# Altium schematic sheet Diode Controllers.SchDoc
size A; Organization: Underwater Robotics; Address1: c/o Student Involvement; Address2: Campus Box 7306; Address3: 2016 Cates Ave. Raleigh, NC 27695; Revision: A1; SheetNumber: 4B; SheetTotal: 4B
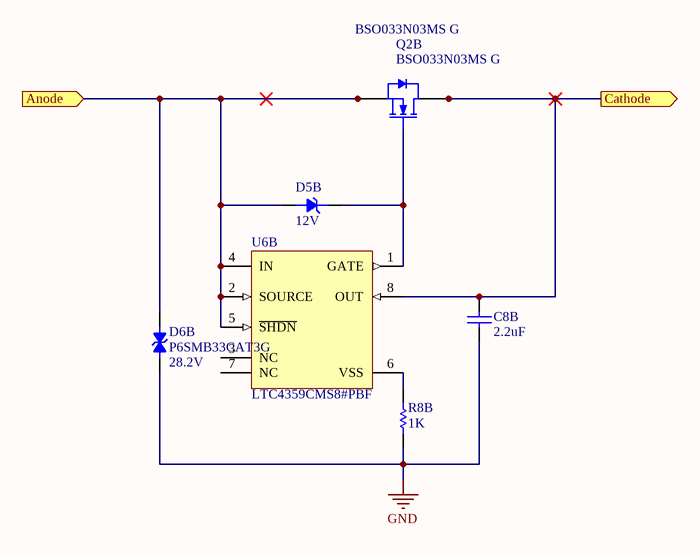
[diagram p0: Diode Controllers.SchDoc]

## Parts
C8B  value 2.2uF  [C1206]  (hidden comment: 2.2uF, C1206 TY , Ceramic MLCC)
D5B  Zener Voltage Vz Typ: 12V  [ONSC-SOD-523-2-502-01_C_V]  (hidden comment: MM5Z12VT1G, 12V Zener)
D6B  value 28.2V  Manufacturer Part Number: P6SMB33CAT3G  [ONSC-SMB-2-403A-03_H_V]  (hidden comment: Bidirectional Zener)
Q2B  BSO033N03MS G  [INF-PG-DSO-8-3_N]
R8B  value 1K  [R0603]  (hidden comment: Resistor)
U6B  LTC4359CMS8#PBF  [LT-MS8-8_N]

## Ports
Anode (in), Cathode (out)

## Nets
GND: C8B.1(+) D6B.2 R8B.1
Anode: D5B.1 D6B.1 Q2B.1(SOURCE) Q2B.2(SOURCE) Q2B.3(SOURCE) U6B.2(SOURCE) U6B.4(IN) U6B.5(~{SHDN}) ; port Anode
Cathode: C8B.2 Q2B.5(DRAIN) Q2B.6(DRAIN) Q2B.7(DRAIN) Q2B.8(DRAIN) U6B.8(OUT) ; port Cathode
NetD5B_2: D5B.2 Q2B.4(GATE) U6B.1(GATE)
NetR8B_2: R8B.2 U6B.6(VSS)

Not connected (* = marked no-connect by the designer): U6B 3(NC) 7(NC)

## Notes on the sheet
- Title
- Size:
- Date:
- A
- Number:
- Time:
- Revision:
- Sheet
- of
- File:

## Library data of the parts
C8B = 2.2uF, C1206 TY , Ceramic MLCC: Ceramic MLCC, Taiyo Yuden, X7R Dielectric; Manufacturer Part Number: UMK316F225ZG-T; Description 1: TAIYO YUDEN - UMK316F225ZG-T - CERAMIC CAPACITOR, 2.2UF, 50V, Y5V, +80,-20%, 1206; Supplier 1: Newark; Supplier Part Number 1: 08P5201; Manufacturer 1: TAIYO YUDEN; RoHS: YES; Stock 1: 1843; Pricing 1: 1=0.055, 10=0.055, 50=0.055, 100=0.055, 500=0.055, 1000=0.05 (USD); ComponentLink1URL: http://www.yuden.co.jp/productdata/catalog/en/mlcc_pack_e.pdf; ComponentLink1Description: http://www.yuden.co.jp/productdata/catalog/en/mlcc_pack_e.pdf; ComponentLink2URL: http://www.farnell.com/datasheets/1481447.pdf; ComponentLink2Description: http://www.farnell.com/datasheets/1481447.pdf
D5B = MM5Z12VT1G, 12V Zener: Zener diode; Manufacturer 1: ON SEMICONDUCTOR; Description 1: ON SEMICONDUCTOR - MM5Z12VT1G - ZENER DIODE, 200mW, 12V, SOD-523; Power Dissipation Pd: 200; Diode Case Style: SOD-523; No. of Pins: 2; Filter Terminals: SMD; Supplier 1: Newark; Supplier Part Number 1: 09R9512; RoHS: YES; Stock 1: 4492; Pricing 1: 1=0.249, 50=0.162, 100=0.068, 250=0.066, 500=0.064, 1000=0.046, 3000=0.037, 9000=0.03 (USD); Zener Tolerance: -; Operating Temperature Max: 150 C; Packaging: Cut Tape; ComponentLink1URL: http://www.farnell.com/datasheets/1840567.pdf; ComponentLink1Description: http://www.farnell.com/datasheets/1840567.pdf; Manufacturer Part Number: MM5Z12VT1G
D6B = P6SMB33CAT3G 28.2V Bidirectional Zener: Bidirectional Zener diode; Manufacturer 1: ON SEMICONDUCTOR; Description 1: ON SEMICONDUCTOR - P6SMB33CAT3G - TVS DIODE, 600W, 33V, SMB; Supplier 1: Newark; Supplier Part Number 1: 42K2552; RoHS: YES; Stock 1: 6401; Pricing 1: 1=0.543, 50=0.36, 100=0.202, 250=0.195, 500=0.19, 1000=0.151, 2500=0.13, 7500=0.126 (USD); ComponentLink1URL: http://www.farnell.com/datasheets/1576153.pdf; ComponentLink1Description: http://www.farnell.com/datasheets/1576153.pdf
Q2B = BSO033N03MS G: N-Channel OptiMOS 3 M-Series Power-MOSFET, 30 V VDS, 22 A ID, -55 to 150 degC, PG-DSO-8-16, Reel, Green; Manufacturer 1: INFINEON; Description 1: INFINEON - BSO033N03MS G - MOSFET, N CHANNEL, 30V, 17A, 8DSO; Transistor Polarity: N Channel; Continuous Drain Current Id: 17; Drain Source Voltage Vds: 30; On Resistance Rds(on): 0.0028; Rds(on) Test Voltage Vgs: 10; Threshold Voltage Vgs: 2; No. of Pins: 8; Supplier 1: Newark; Supplier Part Number 1: 47W3322; Manufacturer Part Number: BSO033N03MS G; RoHS: YES; Stock 1: 1339; Pricing 1: 1=0.868, 10=0.742, 25=0.662, 100=0.594, 250=0.525, 500=0.445, 1000=0.389, 2500=0.358 (USD); ComponentLink1URL: http://www.farnell.com/datasheets/1648231.pdf; ComponentLink1Description: http://www.farnell.com/datasheets/1648231.pdf
R8B = 1k, 5%, 100mW, Yageo, R0603: Manufacturer 1: YAGEO; Manufacturer Part Number: RC0603JR-131KL; Tolerance: 5%; Description 1: YAGEO - RC0603JR-131KL - RES, THICK FILM, 1K, 5%, 0.1W, 0603; Product Range: RC Series; Resistance: 1; Power Rating: 100; Voltage Rating: 50; Resistor Case Style: 0603 [1608 Metric]; Body Height: 0.45; Supplier 1: Newark; Supplier Part Number 1: 68R0220; RoHS: YESX; Stock 1: 36430; Pricing 1: 1=0.06, 10=0.011, 25=0.008, 100=0.005, 250=0.003, 1000=0.002 (USD); Resistance Tolerance: 5%; Packaging: Cut Tape; MSL: -; ComponentLink1URL: http://www.farnell.com/datasheets/1868787.pdf; ComponentLink1Description: http://www.farnell.com/datasheets/1868787.pdf; ComponentLink2URL: http://www.yageo.com/pdf/PYu-RC0603_51_RoHS_L_4.pdf; ComponentLink2Description: http://www.yageo.com/pdf/PYu-RC0603_51_RoHS_L_4.pdf
U6B = LTC4359CMS8#PBF: Ideal Diode Controller with Reverse Input Protection, 4 to 80 V Vin, 8-pin SOP (MS8-8), 0 to 70 degC, Pb-Free; Manufacturer 1: Linear Technology; Description 1: IC OR CTRLR N+1 8MSOP; FET Type: N-Channel; Ratio - Input:Output: N:1; Internal Switch(s): No; Delay Time - ON: 200µs; Delay Time - OFF: 300ns; Current - Supply: 150µA; Voltage - Supply: 4 V ~ 80 V; Supplier 1: Digi-Key; Supplier Part Number 1: LTC4359CMS8#PBF-ND; Manufacturer Part Number: LTC4359CMS8#PBF; RoHS: RoHS Compliant; Category: Integrated Circuits (ICs); Stock 1: 223; Pricing 1: 1=4.5, 25=3, 100=2.55 (USD); Packaging: Tube; Type: N+1 ORing Controller; Current - Output (Max): -; Applications: Automotive, Redundant Power Supplies, Telecom Infrastructure; Operating Temperature: 0°C ~ 70°C; Mounting Type: Surface Mount; Package / Case: 8-TSSOP, 8-MSOP (0.118", 3.00mm Width); Supplier Device Package: 8-MSOP; ComponentLink1URL: http://www.linear.com/docs/41608; ComponentLink1Description: http://www.linear.com/docs/41608